# Altium schematic sheet LORA.SchDoc
size A4
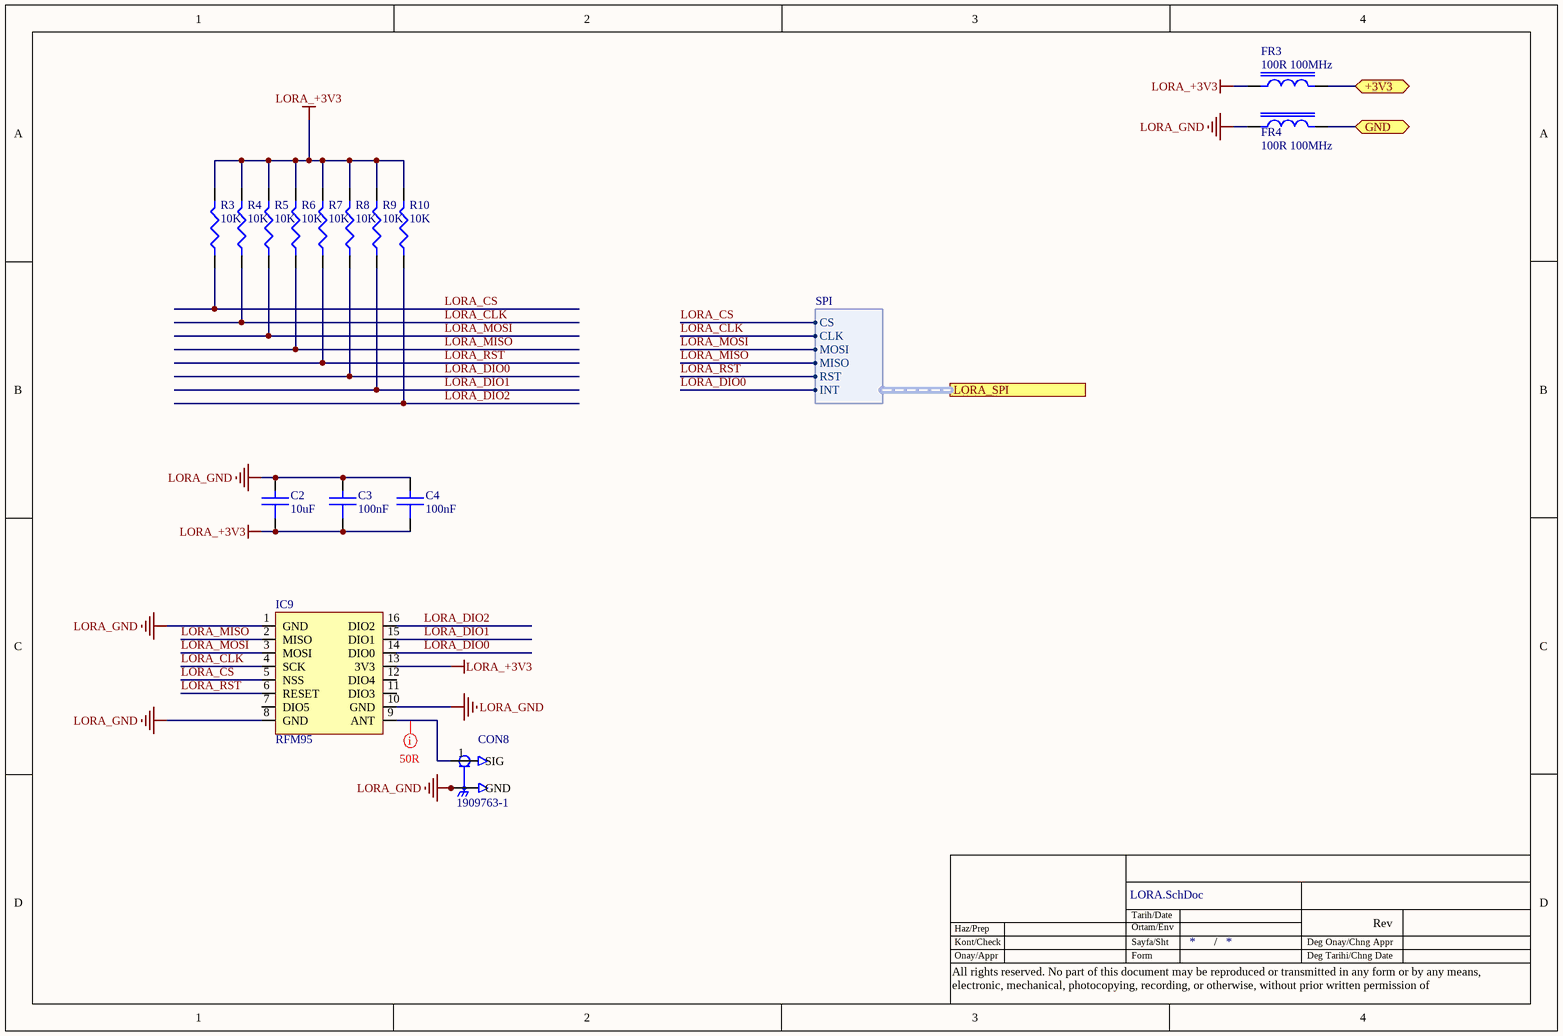
[diagram p0: LORA.SchDoc]

## Parts
C2  10uF  [C0603]
C3  100nF  [C0603]
C4  100nF  [C0603]
CON8  1909763-1  [TE_1909763-1]
FR3  100R 100MHz  [FR_0603]
FR4  100R 100MHz  [FR_0603]
IC9  RFM95  [RFM95]
R3  10K  [R0603]
R4  10K  [R0603]
R5  10K  [R0603]
R6  10K  [R0603]
R7  10K  [R0603]
R8  10K  [R0603]
R9  10K  [R0603]
R10  10K  [R0603]

## Ports
+3V3 (bidir), GND (bidir), LORA_SPI (harness SPI)

## Harnesses
SPI: MOSI, MISO, CLK, CS, INT, RST

## Nets
LORA_+3V3: C2.2 C3.2 C4.2 FR3.1 IC9.13(3V3) R3.2 R4.2 R5.2 R6.2 R7.2 R8.2 R9.2 R10.2
LORA_GND: C2.1 C3.1 C4.1 CON8.2(GND) CON8.3(GND) FR4.1 IC9.1(GND) IC9.8(GND) IC9.10(GND)
+3V3: FR3.2 ; port +3V3
GND: FR4.2 ; port GND
LORA_CLK: IC9.4(SCK) R4.1 ; port LORA_SPI.CLK
LORA_CS: IC9.5(NSS) R3.1 ; port LORA_SPI.CS
LORA_DIO0: IC9.14(DIO0) R8.1 ; port LORA_SPI.INT
LORA_DIO1: IC9.15(DIO1) R9.1
LORA_DIO2: IC9.16(DIO2) R10.1
LORA_MISO: IC9.2(MISO) R6.1 ; port LORA_SPI.MISO
LORA_MOSI: IC9.3(MOSI) R5.1 ; port LORA_SPI.MOSI
LORA_RST: IC9.6(RESET) R7.1 ; port LORA_SPI.RST
NetCON8_1: CON8.1(SIG) IC9.9(ANT)

Not connected (* = marked no-connect by the designer): IC9 7(DIO5) 11(DIO3) 12(DIO4)

## Layout directives
net class 50R: NetCON8_1

## Notes on the sheet
- Tarih/Date
- Haz/Prep
- Kont/Check
- Onay/Appr
- Sayfa/Sht
- Form
- Ortam/Env
- /
- Deg Tarihi/Chng Date
- Deg Onay/Chng Appr
- Rev
- All rights reserved. No part of this document may be reproduced or transmitted in any form or by any means, electronic, mechanical, photocopying, recording, or otherwise, without prior written permission of

## Library data of the parts
C2 = CC0603MRX5R6BB106: 10uF 10V X5R 20% SMD 0603 85C Paper T/R; Manufacturer: Yageo; Supplier 1: Digi-Key; Supplier Part Number 1: 311-1817-1-ND; Manufacturer Part Number: CC0603MRX5R6BB106; Stock 1: 209492; Pricing 1: 1 = 0,20000, 10 = 0,13700, 50 = 0,08200, 100 = 0,06920, 500 = 0,04736, 1000 = 0,04190 (USD); RoHS: Yes; Mount: Surface Mount; Case/Package: 0603; Case Code (Imperial): 0603; Case Code (Metric): 1608; Weight: 7.1E-05oz; Min Operating Temperature: -55°C; Max Operating Temperature: 85°C; Voltage Rating: 10V; Termination: SMD/SMT; Resistor Type: Ceramic; Dielectric: X5R; Tolerance: 20%; Packaging: Tape and Reel; Capacitance: 10uF; Voltage Rating (DC): 10V; Length: 0.063inch; Width: 0.031inch; Thickness: 0.035inch; Depth: 0.8mm; Lead Free: Lead Free; Halogen Free: Halogen Free; ComponentLink1URL: http://components.arrow.com/part/dataview/0323_03079270?src-supplier=Arrow+Europe; ComponentLink1Description: http://components.arrow.com/part/dataview/0323_03079270?src-supplier=Arrow+Europe; ComponentLink2URL: http://www.mouser.com/ds/2/447/UPY-GPHC_X5R_4V-to-50V_25-1131599.pdf?src-supplier=Mouser; ComponentLink2Description: http://www.mouser.com/ds/2/447/UPY-GPHC_X5R_4V-to-50V_25-1131599.pdf?src-supplier=Mouser; ComponentLink3URL: http://www.yageo.com/documents/recent/UPY-GPHC_X5R_4V-to-50V_25.pdf?src-supplier=Digi-Key; ComponentLink3Description: http://www.yageo.com/documents/recent/UPY-GPHC_X5R_4V-to-50V_25.pdf?src-supplier=Digi-Key; Category: Capasitor
C3 C4 = CC0603KRX7R8BB104: 100nF, 25V, X7R, 10%, 0603; Manufacturer: Yageo; Supplier 1: Digi-Key; Supplier Part Number 1: 311-1341-1-ND; Manufacturer Part Number: CC0603KRX7R8BB104; Stock 1: 10150433; Pricing 1: 1 = 0,10000, 10 = 0,04500, 50 = 0,02480, 100 = 0,02020, 500 = 0,01444, 1000 = 0,01134 (USD); RoHS: Yes; Mount: Surface Mount; Case/Package: 0603; Number of Pins: 2; Case Code (Imperial): 0603; Case Code (Metric): 1608; Min Operating Temperature: -55°C; Max Operating Temperature: 125°C; Capacitance: 100nF; Tolerance: 10%; Voltage Rating: 25V; Packaging: Tape and Reel; Package Quantity: 1; Voltage Rating (DC): 25V; Dielectric: X7R; Termination: SMD/SMT; Resistor Type: Ceramic; Voltage: 25V; Length: 1.6mm; Width: 0.8mm; Height: 0.8mm; Thickness: 0.035inch; Depth: 0.8mm; Radiation Hardening: No; REACH SVHC: Unknown; Lead Free: Lead Free; Halogen Free: Halogen Free; ComponentLink1URL: https://datasheet.ciiva.com/11786/0900766b80c10176-11786120.pdf?src-supplier=RSComponents; ComponentLink1Description: https://datasheet.ciiva.com/11786/0900766b80c10176-11786120.pdf?src-supplier=RSComponents; ComponentLink2URL: https://datasheet.ciiva.com/144/mlccorderingcode-144075.pdf?src-supplier=Digi-Key; ComponentLink2Description: https://datasheet.ciiva.com/144/mlccorderingcode-144075.pdf?src-supplier=Digi-Key; ComponentLink3URL: https://datasheet.ciiva.com/17434/upy-gphc-x7r-6-3v-to-50v-8-17434263.pdf?src-supplier=Avnet+Europe; ComponentLink3Description: https://datasheet.ciiva.com/17434/upy-gphc-x7r-6-3v-to-50v-8-17434263.pdf?src-supplier=Avnet+Europe; ComponentLink4URL: https://datasheet.ciiva.com/26829/getdatasheetpartid-403577-26829431.pdf?src-supplier=Verical; ComponentLink4Description: https://datasheet.ciiva.com/26829/getdatasheetpartid-403577-26829431.pdf?src-supplier=Verical; ComponentLink5URL: https://datasheet.ciiva.com/11587/upy-gphc-x7r-6-3v-to-50v-8-11587208.pdf?src-supplier=Avnet; ComponentLink5Description: https://datasheet.ciiva.com/11587/upy-gphc-x7r-6-3v-to-50v-8-11587208.pdf?src-supplier=Avnet; ComponentLink6URL: https://datasheet.ciiva.com/13389/upy-gphc-x7r-6-3v-to-50v-8-13389352.pdf?src-supplier=Mouser; ComponentLink6Description: https://datasheet.ciiva.com/13389/upy-gphc-x7r-6-3v-to-50v-8-13389352.pdf?src-supplier=Mouser; ComponentLink7URL: https://datasheet.ciiva.com/28450/1489800-28450584.pdf?src-supplier=Element14; ComponentLink7Description: https://datasheet.ciiva.com/28450/1489800-28450584.pdf?src-supplier=Element14; ComponentLink8URL: https://datasheet.ciiva.com/144/mlccorderingcode-144073.pdf?src-supplier=Digi-Key; ComponentLink8Description: https://datasheet.ciiva.com/144/mlccorderingcode-144073.pdf?src-supplier=Digi-Key; ComponentLink9URL: https://datasheet.ciiva.com/144/mlccorderingcode-144074.pdf?src-supplier=Digi-Key; ComponentLink9Description: https://datasheet.ciiva.com/144/mlccorderingcode-144074.pdf?src-supplier=Digi-Key; ComponentLink10URL: https://datasheet.ciiva.com/7978/1489800-7978155.pdf?src-supplier=Element14; ComponentLink10Description: https://datasheet.ciiva.com/7978/1489800-7978155.pdf?src-supplier=Element14; Category: Capasitor
CON8 = 1909763-1: CONN UMCC JACK STR 50OHM SMD; Manufacturer: TE Connectivity AMP; Body Material: Polymer,Liquid Crystal Polymer; Body Plating: Gold; Dielectric Material: Polymer; Gender: Female; Impedance: 50R; Max Frequency: 6GHz; Connector System: Cable-to-Board; Number of Positions: 1; Sealable: No (Without); Voltage Rating: 60V; Mating Cycles: 30; Insertion Loss: 0.24dB; Supplier 1: Digi-Key; Supplier Part Number 1: A118077CT-ND; Manufacturer Part Number: 1909763-1; Stock 1: 168700; Pricing 1: 1 = 0,46000, 10 = 0,42900, 25 = 0,38600, 50 = 0,34300, 100 = 0,32860, 250 = 0,30008, 500 = 0,28578, 1000 = 0,23577, 2500 = 0,21434 (USD); RoHS: Yes; Mount: Panel; Case/Package: SMD/SMT; Contact Plating: Gold; Contact Material: Copper Alloy; Housing Color: Beige; Insulation Material: Thermoplastic; Center Contact Plating: Gold; Min Operating Temperature: -40°C; Max Operating Temperature: 194°C; Packaging: Tape and Reel; Package Quantity: 1; Fastening Type: SNAP-ON,Pull; Termination: SMD/SMT; Orientation: Straight; Connector Type: Jack; Frequency: 6GHz; Series: -; Number of Ports: 1; Length: 3mm; Radiation Hardening: No; ELV: Compliant; Lead Free: Lead Free; RoHS Compliant: Yes; ComponentLink1URL: https://datasheet.ciiva.com/16312/eng-cd-1909763-b-16312469.pdf?src-supplier=Future+Electronics; ComponentLink1Description: https://datasheet.ciiva.com/16312/eng-cd-1909763-b-16312469.pdf?src-supplier=Future+Electronics; ComponentLink2URL: https://datasheet.ciiva.com/16469/eng-cd-1909763-b-16469221.pdf?src-supplier=Avnet+Asia; ComponentLink2Description: https://datasheet.ciiva.com/16469/eng-cd-1909763-b-16469221.pdf?src-supplier=Avnet+Asia; ComponentLink3URL: https://datasheet.ciiva.com/9423/eng-cd-1909763-b-9423785.pdf?src-supplier=Avnet; ComponentLink3Description: https://datasheet.ciiva.com/9423/eng-cd-1909763-b-9423785.pdf?src-supplier=Avnet; ComponentLink4URL: https://datasheet.ciiva.com/29191/eng-cd-1909763-b1-basefilename-29191146.pdf?src-supplier=Digi-Key; ComponentLink4Description: https://datasheet.ciiva.com/29191/eng-cd-1909763-b1-basefilename-29191146.pdf?src-supplier=Digi-Key; ComponentLink5URL: https://datasheet.ciiva.com/29191/eng-cd-1909763-b1-basefilename-29191148.pdf?src-supplier=Digi-Key; ComponentLink5Description: https://datasheet.ciiva.com/29191/eng-cd-1909763-b1-basefilename-29191148.pdf?src-supplier=Digi-Key; Category: Connectors, Interconnects - Coaxial Connectors (RF)
FR3 FR4 = 742792620: 100Ohm 100MHz 500mA 0603 SMD; Manufacturer: Wurth Electronics; Tolerance: 25%; Resistance: 150mR; Number of Lines: 1; Supplier 1: Digi-Key; Supplier Part Number 1: 732-1579-1-ND; Manufacturer Part Number: 742792620; Stock 1: 4265; Pricing 1: 1 = 0,14000, 50 = 0,14000, 100 = 0,12900, 500 = 0,12300, 1000 = 0,11800, 2000 = 0,11200 (USD); RoHS: Yes; Mount: Surface Mount; Case/Package: SMD/SMT; Number of Pins: 2; Weight: 0.000141oz; Case Code (Metric): 1608; Case Code (Imperial): 0603; Material: Ferrite; Min Operating Temperature: -55°C; Max Operating Temperature: 125°C; Package Quantity: 1; Current Rating: 500mA; Packaging: Tape and Reel; Impedance: 100R; Max Current Rating: 500mA; DC Resistance (DCR): 150mR; Max DC Current: 500mA; Termination: SMD/SMT; Test Frequency: 100MHz; Length: 1.6mm; Width: 0.8mm; Height: 0.8mm; Depth: 0.8mm; REACH SVHC: Unknown; Lead Free: Lead Free; ComponentLink1URL: https://datasheet.ciiva.com/1013/742792620-1013392.pdf?src-supplier=Digi-Key; ComponentLink1Description: https://datasheet.ciiva.com/1013/742792620-1013392.pdf?src-supplier=Digi-Key; ComponentLink2URL: https://datasheet.ciiva.com/30489/0900766b812a674b-30489152.pdf?src-supplier=RSComponents; ComponentLink2Description: https://datasheet.ciiva.com/30489/0900766b812a674b-30489152.pdf?src-supplier=RSComponents; ComponentLink3URL: https://datasheet.ciiva.com/23762/742792620-23762994.pdf?src-supplier=Newark; ComponentLink3Description: https://datasheet.ciiva.com/23762/742792620-23762994.pdf?src-supplier=Newark; ComponentLink4URL: https://datasheet.ciiva.com/22711/530503-22711411.pdf?src-supplier=Element14; ComponentLink4Description: https://datasheet.ciiva.com/22711/530503-22711411.pdf?src-supplier=Element14; ComponentLink5URL: https://datasheet.ciiva.com/4940/742792620-81075-4940413.pdf?src-supplier=Mouser; ComponentLink5Description: https://datasheet.ciiva.com/4940/742792620-81075-4940413.pdf?src-supplier=Mouser; ComponentLink6URL: https://datasheet.ciiva.com/1013/742792620-1013393.pdf?src-supplier=Digi-Key; ComponentLink6Description: https://datasheet.ciiva.com/1013/742792620-1013393.pdf?src-supplier=Digi-Key; ComponentLink7URL: https://datasheet.ciiva.com/1013/742792620-1013394.pdf?src-supplier=Digi-Key; ComponentLink7Description: https://datasheet.ciiva.com/1013/742792620-1013394.pdf?src-supplier=Digi-Key; ComponentLink8URL: https://datasheet.ciiva.com/1466/530503-1466423.pdf?src-supplier=Element14; ComponentLink8Description: https://datasheet.ciiva.com/1466/530503-1466423.pdf?src-supplier=Element14; ComponentLink9URL: https://datasheet.ciiva.com/48698/001087044-da-01-ml-we-cbf-smd-ferrit-742792620-de-en-48698348.pdf?src-supplier=Conrad; ComponentLink9Description: https://datasheet.ciiva.com/48698/001087044-da-01-ml-we-cbf-smd-ferrit-742792620-de-en-48698348.pdf?src-supplier=Conrad; Category: Filters - Ferrite Beads and Chips
IC9 = RFM95: RFM95 ULTRA-LONG RANGE TRANSCEIV; Manufacturer: Seeed Studio; Manufacturer Part Number: 109990166; Supplier 1: Digi-Key; Stock 1: 987; Pricing 1: 1 = 7,09000 (USD); RoHS: No; ComponentLink1URL: https://github.com/SeeedDocument/RFM95-98_LoRa_Module/blob/master/RFM95_96_97_98_DataSheet.pdf?src-supplier=Digi-Key; ComponentLink1Description: https://github.com/SeeedDocument/RFM95-98_LoRa_Module/blob/master/RFM95_96_97_98_DataSheet.pdf?src-supplier=Digi-Key; Supplier Part Number 1: 1597-1488-ND; Category: Module
R3-R10 = RT0603FRE0710KL: 10K OHM 1% 1/10W 0603; Manufacturer: Yageo; Resistance: 10kR; Power Rating: 100mW; Voltage Rating: 75V; Temperature Coefficient: 50ppm/°C; Supplier 1: Digi-Key; Supplier Part Number 1: YAG2321CT-ND; Manufacturer Part Number: RT0603FRE0710KL; Stock 1: 326134; Pricing 1: 1 = 0,10000, 10 = 0,05600, 100 = 0,02270, 1000 = 0,01020, 2500 = 0,00886 (USD); RoHS: Yes; Case/Package: 0603; Number of Pins: 2; Case Code (Metric): 1608; Case Code (Imperial): 0603; Contact Plating: Tin,Lead; Min Operating Temperature: -55°C; Max Operating Temperature: 125°C; Package Quantity: 5000; Packaging: Tape and Reel; Tolerance: 1%; Resistor Type: Thin Film; Number of Terminations: 2; Termination: SMD/SMT; Max Power Dissipation: 100mW; Voltage Rating (DC): 75V; Features: Moisture Resistant; Length: 0.063inch; Width: 0.031inch; Height: 0.022inch; Depth: 0.8mm; REACH SVHC: Unknown; Military Standard: Not; Lead Free: Lead Free; ComponentLink1URL: https://datasheet.ciiva.com/2559/pyu-rt-1-to-0-05-rohs-l-5-2559482.pdf?src-supplier=Digi-Key; ComponentLink1Description: https://datasheet.ciiva.com/2559/pyu-rt-1-to-0-05-rohs-l-5-2559482.pdf?src-supplier=Digi-Key; ComponentLink2URL: https://datasheet.ciiva.com/16745/pyu-rt-1-to-0-05-rohs-l-4-16745739.pdf?src-supplier=Future+Electronics; ComponentLink2Description: https://datasheet.ciiva.com/16745/pyu-rt-1-to-0-05-rohs-l-4-16745739.pdf?src-supplier=Future+Electronics; ComponentLink3URL: https://datasheet.ciiva.com/12694/pyu-rt-1-to-0-05-rohs-l-4-12694910.pdf?src-supplier=Mouser; ComponentLink3Description: https://datasheet.ciiva.com/12694/pyu-rt-1-to-0-05-rohs-l-4-12694910.pdf?src-supplier=Mouser; Category: Resistor